# Altium schematic sheet MiniSystem&Ports.SchDoc: K60最小系统及接口
size A3; DrawnBy: 罗琪; Engineer: 罗琪; Revision: 4.0; SheetNumber: 1
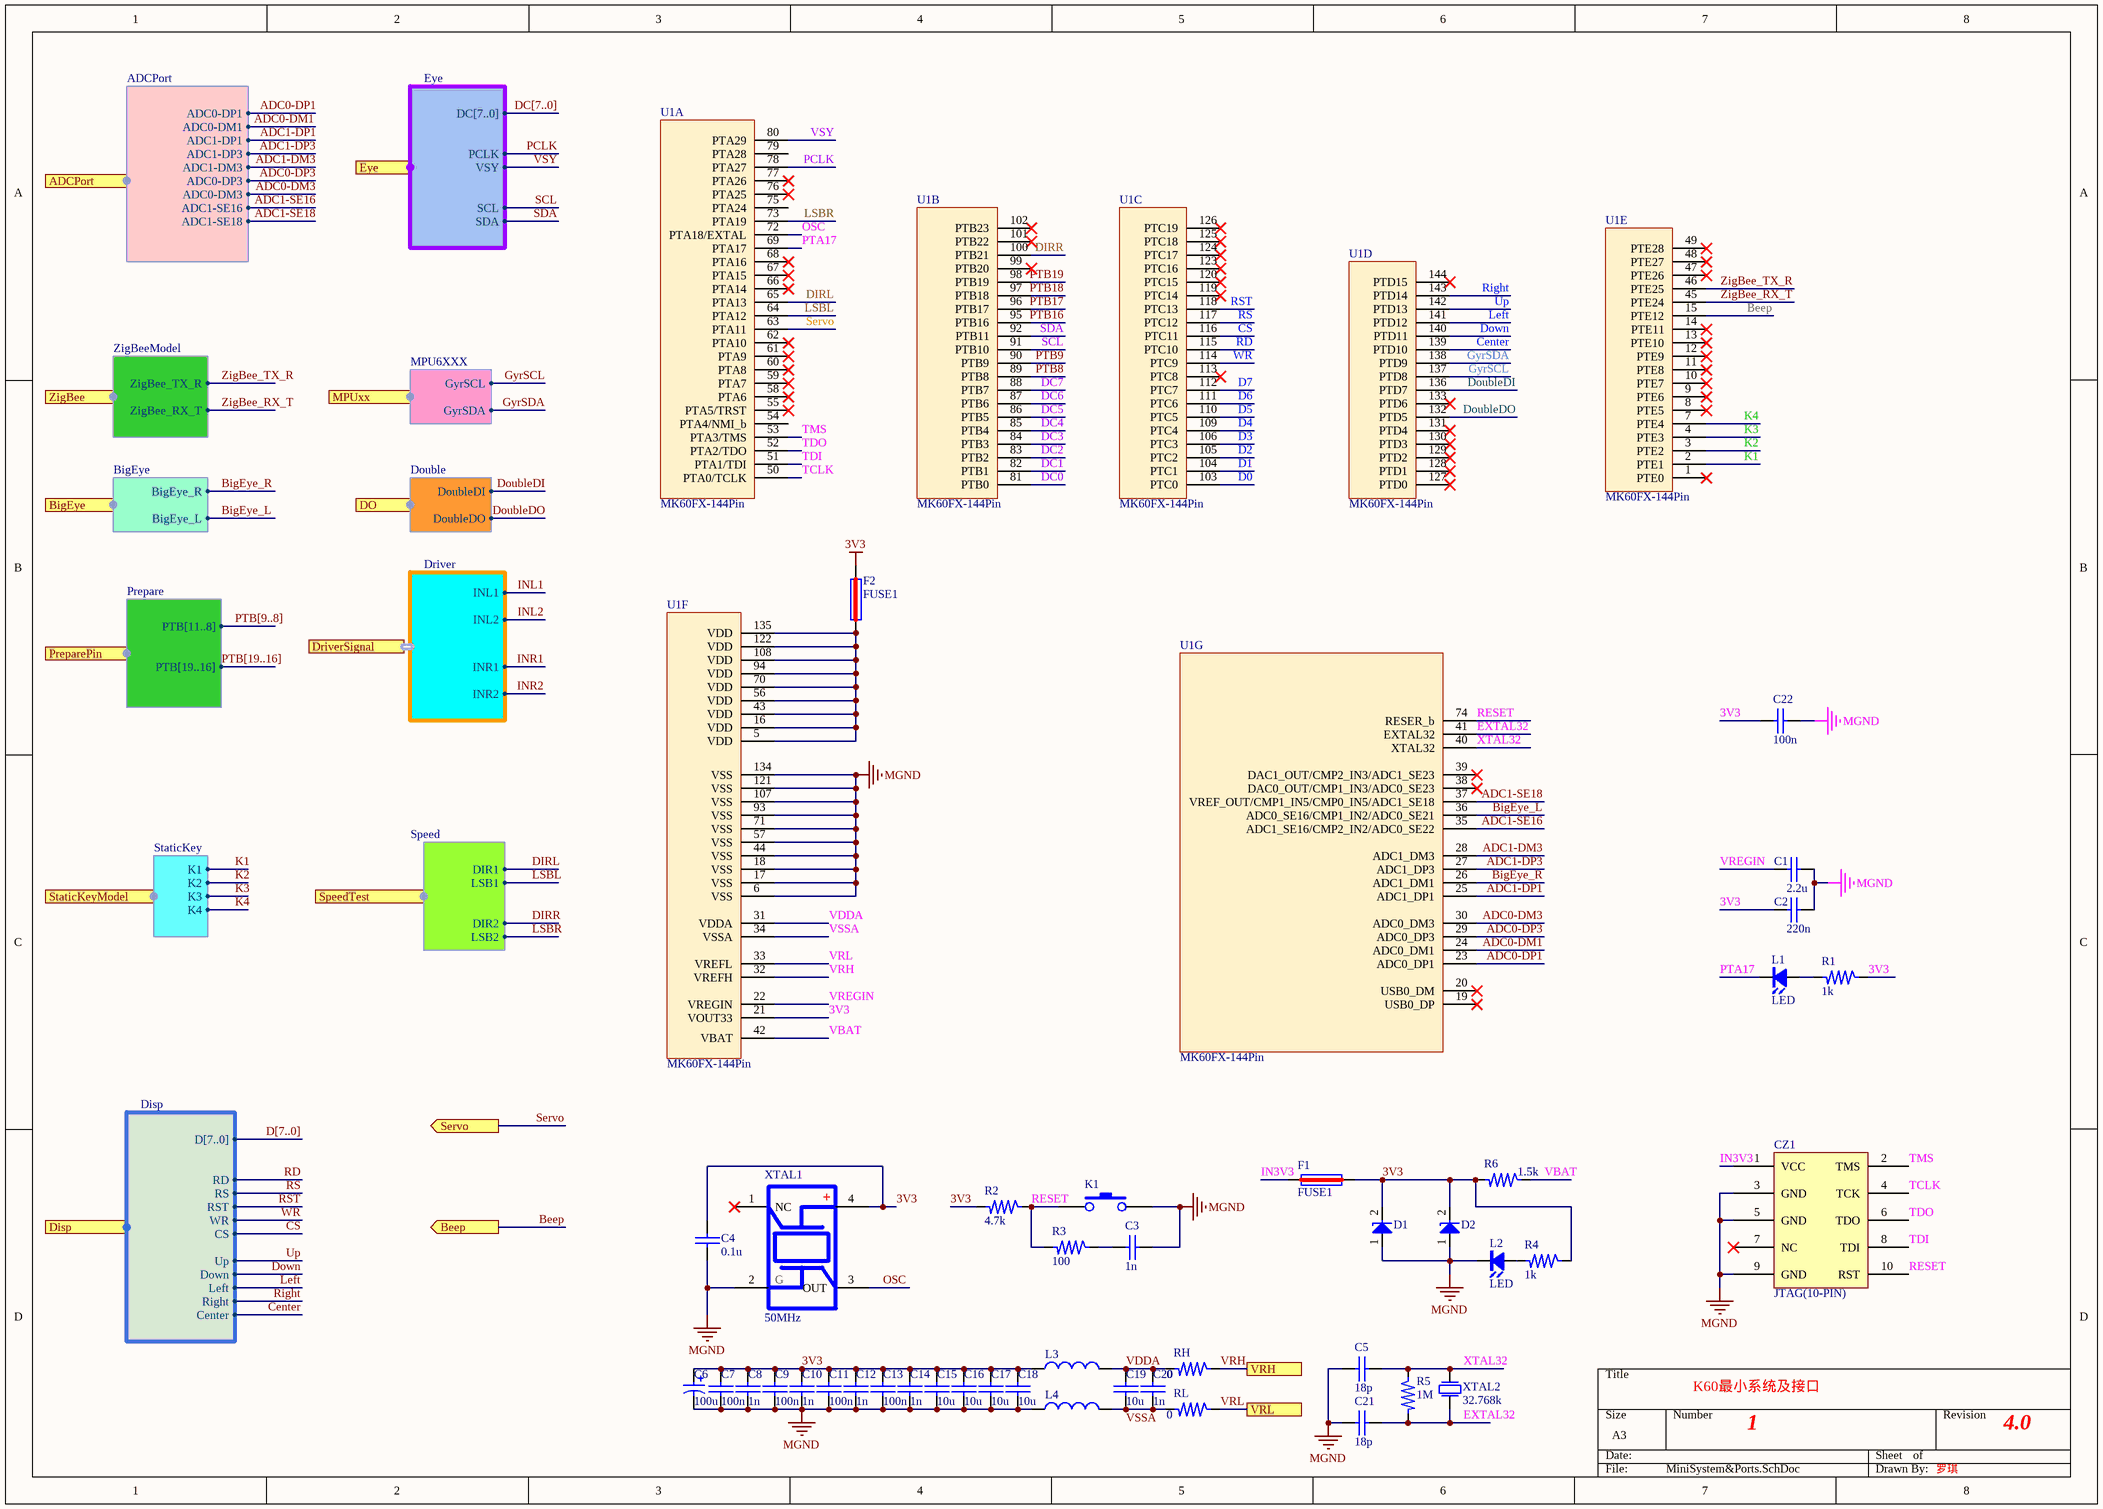
[diagram p0: MiniSystem&Ports.SchDoc]

## Parts
C1  2.2u  [C0603]
C2  220n  [C0603]
C3  1n  [C0603]
C4  0.1u  [C0603]
C5  18p  [C0603]
C6  100u  [CAP-E SMD-C]
C7  100n  [C0603]
C8  1n  [C0603]
C9  100n  [C0603]
C10  1n  [C0603]
C11  100n  [C0603]
C12  1n  [C0603]
C13  100n  [C0603]
C14  1n  [C0603]
C15  10u  [C0805]
C16  10u  [C0805]
C17  10u  [C0805]
C18  10u  [C0805]
C19  10u  [C0805]
C20  1n  [C0603]
C21  18p  [C0603]
C22  100n  [C0603]
CZ1  JTAG(10-PIN)  [JTAG 10-pin Header]
D1  EN5819  [D1206]  (value not drawn)
D2  EN5819  [D1206]  (value not drawn)
F1  FUSE1  [FUSE-F1210]
F2  FUSE1  [FUSE-F1210]
K1  SW  [KEY-K2]  (value not drawn)
L1  LED  [LED0805TB]
L2  LED  [LED0805TB]
L3  INDUCTOR  [L0805]  (value not drawn)
L4  INDUCTOR  [L0805]  (value not drawn)
R1  1k  [R0603]
R2  4.7k  [R0603]
R3  100  [R0603]
R4  1k  [R0603]
R5  1M  [R0603]
R6  1.5k  [R0603]
RH  0  [R0603]
RL  0  [R0603]
U1  MK60FX-144Pin  [LQFP144]  (parts A,B,C,D,E,F,G of 7)
XTAL1  50MHz  [XTAL-6035]
XTAL2  32.768k  [XTAL_32.768]

## Ports
ADCPort (harness ADCPort), Beep (out), BigEye (harness BigEye), Disp (harness Disp), DO (harness Double), DriverSignal (harness Driver), Eye (harness Eye), MPUxx (harness MPU6XXX), PreparePin (harness Prepare), Servo (out), SpeedTest (harness Speed), StaticKeyModel (harness StaticKey), VRH, VRL, ZigBee (harness ZigBeeModel)

## Harnesses
MPU6XXX: GyrSCL, GyrSDA
ZigBeeModel: ZigBee_TX_R, ZigBee_RX_T
BigEye: BigEye_R, BigEye_L
Double: DoubleDI, DoubleDO
ADCPort: ADC0-DP1, ADC0-DM1, ADC1-DP1, ADC1-DP3, ADC1-DM3, ADC0-DP3, ADC0-DM3, ADC1-SE16, ADC1-SE18
Prepare: PTB[11..8], PTB[19..16]
Driver: INL1, INL2, INR1, INR2
Disp: D[7..0], RD, RS, RST, WR, Up, Down, Left, Right, Center, CS
Eye: DC[7..0], PCLK, VSY, SCL, SDA
StaticKey: K1, K2, K3, K4
Speed: DIR1, LSB1, LSB2, DIR2

## Nets
3V3: C2.2 C4.1 C6.1 C7.2 C8.2 C9.2 C10.2 C11.2 C12.2 C13.2 C14.2 C15.2 C16.2 C17.2 C18.2 C22.1 D1.2 D2.2 F1.2 F2.2 L3.1 R1.2 R2.1 R4.2 R6.1 U1.21(VOUT33) XTAL1.4(VCC)
MGND: C1.1 C2.1 C3.2 C4.2 C5.1 C6.2 C7.1 C8.1 C9.1 C10.1 C11.1 C12.1 C13.1 C14.1 C15.1 C16.1 C17.1 C18.1 C21.1 C22.2 CZ1.3(GND) CZ1.5(GND) CZ1.9(GND) D1.1 D2.1 K1.2 L2.2(K) L4.1 U1.6(VSS) U1.17(VSS) U1.18(VSS) U1.44(VSS) U1.57(VSS) U1.71(VSS) U1.93(VSS) U1.107(VSS) U1.121(VSS) U1.134(VSS) XTAL1.2(GND)
ADC0-DM1: U1.24(ADC0_DM1) ; port ADCPort.ADC0-DM1
ADC0-DM3: U1.30(ADC0_DM3) ; port ADCPort.ADC0-DM3
ADC0-DP1: U1.23(ADC0_DP1) ; port ADCPort.ADC0-DP1
ADC0-DP3: U1.29(ADC0_DP3) ; port ADCPort.ADC0-DP3
ADC1-DM3: U1.28(ADC1_DM3) ; port ADCPort.ADC1-DM3
ADC1-DP1: U1.25(ADC1_DP1) ; port ADCPort.ADC1-DP1
ADC1-DP3: U1.27(ADC1_DP3) ; port ADCPort.ADC1-DP3
ADC1-SE16: U1.35(ADC1_SE16/CMP2_IN2/ADC0_SE22) ; port ADCPort.ADC1-SE16
ADC1-SE18: U1.37(VREF_OUT/CMP1_IN5/CMP0_IN5/ADC1_SE18) ; port ADCPort.ADC1-SE18
Beep: U1.15(PTE12) ; port Beep
BigEye_L: U1.36(ADC0_SE16/CMP1_IN2/ADC0_SE21) ; port BigEye.BigEye_L
BigEye_R: U1.26(ADC1_DM1) ; port BigEye.BigEye_R
Center: U1.139(PTD10) ; port Disp.Center
CS: U1.116(PTC11) ; port Disp.CS
D0: U1.103(PTC0)
D1: U1.104(PTC1)
D2: U1.105(PTC2)
D3: U1.106(PTC3)
D4: U1.109(PTC4)
D5: U1.110(PTC5)
D6: U1.111(PTC6)
D7: U1.112(PTC7)
DC0: U1.81(PTB0)
DC1: U1.82(PTB1)
DC2: U1.83(PTB2)
DC3: U1.84(PTB3)
DC4: U1.85(PTB4)
DC5: U1.86(PTB5)
DC6: U1.87(PTB6)
DC7: U1.88(PTB7)
DIRL: U1.65(PTA13) ; port SpeedTest.DIR1
DIRR: U1.100(PTB21) ; port SpeedTest.DIR2
DoubleDI: U1.136(PTD7) ; port DO.DoubleDI
DoubleDO: U1.132(PTD5) ; port DO.DoubleDO
Down: U1.140(PTD11) ; port Disp.Down
EXTAL32: C21.2 R5.1 U1.41(EXTAL32) XTAL2.2(P2)
GyrSCL: U1.137(PTD8) ; port MPUxx.GyrSCL
GyrSDA: U1.138(PTD9) ; port MPUxx.GyrSDA
IN3V3: CZ1.1(VCC) F1.1
INL1: port DriverSignal.INL1
INL2: port DriverSignal.INL2
INR1: port DriverSignal.INR1
INR2: port DriverSignal.INR2
K1: U1.2(PTE1) ; port StaticKeyModel.K1
K2: U1.3(PTE2) ; port StaticKeyModel.K2
K3: U1.4(PTE3) ; port StaticKeyModel.K3
K4: U1.7(PTE4) ; port StaticKeyModel.K4
Left: U1.141(PTD12) ; port Disp.Left
LSBL: U1.64(PTA12) ; port SpeedTest.LSB1
LSBR: U1.73(PTA19) ; port SpeedTest.LSB2
OSC: U1.72(PTA18/EXTAL) XTAL1.3(OUT)
PCLK: U1.78(PTA27) ; port Eye.PCLK
PTA17: L1.2(K) U1.69(PTA17)
PTB8: U1.89(PTB8)
PTB9: U1.90(PTB9)
PTB16: U1.95(PTB16)
PTB17: U1.96(PTB17)
PTB18: U1.97(PTB18)
PTB19: U1.98(PTB19)
RD: U1.115(PTC10) ; port Disp.RD
RESET: CZ1.10(RST) K1.1 R2.2 R3.1 U1.74(RESER_b)
Right: U1.143(PTD14) ; port Disp.Right
RS: U1.117(PTC12) ; port Disp.RS
RST: U1.118(PTC13) ; port Disp.RST
SCL: U1.91(PTB10) ; port Eye.SCL
SDA: U1.92(PTB11) ; port Eye.SDA
Servo: U1.63(PTA11) ; port Servo
TCLK: CZ1.4(TCK) U1.50(PTA0/TCLK)
TDI: CZ1.8(TDI) U1.51(PTA1/TDI)
TDO: CZ1.6(TDO) U1.52(PTA2/TDO)
TMS: CZ1.2(TMS) U1.53(PTA3/TMS)
Up: U1.142(PTD13) ; port Disp.Up
VBAT: R6.2 U1.42(VBAT)
VDDA: C19.2 C20.2 L3.2 RH.1 U1.31(VDDA)
VREGIN: C1.2 U1.22(VREGIN)
VRH: RH.2 U1.32(VREFH) ; port VRH
VRL: RL.2 U1.33(VREFL) ; port VRL
VSSA: C19.1 C20.1 L4.2 RL.1 U1.34(VSSA)
VSY: U1.80(PTA29) ; port Eye.VSY
WR: U1.114(PTC9) ; port Disp.WR
XTAL32: C5.2 R5.2 U1.40(XTAL32) XTAL2.1(P1)
ZigBee_RX_T: U1.45(PTE24) ; port ZigBee.ZigBee_RX_T
ZigBee_TX_R: U1.46(PTE25) ; port ZigBee.ZigBee_TX_R
NetC3_1: C3.1 R3.2
NetF2_1: F2.1 U1.5(VDD) U1.16(VDD) U1.43(VDD) U1.56(VDD) U1.70(VDD) U1.94(VDD) U1.108(VDD) U1.122(VDD) U1.135(VDD)
NetL1_1: L1.1(A) R1.1
NetL2_1: L2.1(A) R4.1

Not connected (* = marked no-connect by the designer): CZ1 7(NC)*; U1 1(PTE0)* 8(PTE5)* 9(PTE6)* 10(PTE7)* 11(PTE8)* 12(PTE9)* 13(PTE10)* 14(PTE11)* 19(USB0_DP)* 20(USB0_DM)* 38(DAC0_OUT/CMP1_IN3/ADC0_SE23)* 39(DAC1_OUT/CMP2_IN3/ADC1_SE23)* 47(PTE26)* 48(PTE27)* 49(PTE28)* 54(PTA4/NMI_b) 55(PTA5/TRST)* 58(PTA6)* 59(PTA7)* 60(PTA8)* 61(PTA9)* 62(PTA10)* 66(PTA14)* 67(PTA15)* 68(PTA16)* 75(PTA24) 76(PTA25)* 77(PTA26)* 79(PTA28) 99(PTB20)* 101(PTB22)* 102(PTB23)* 113(PTC8)* 119(PTC14)* 120(PTC15)* 123(PTC16)* 124(PTC17)* 125(PTC18)* 126(PTC19)* 127(PTD0)* 128(PTD1)* 129(PTD2)* 130(PTD3)* 131(PTD4)* 133(PTD6)* 144(PTD15)*; XTAL1 1(NC)*

## Buses and harness runs
bus D[7..0]
bus DC[7..0]
bus PTB[9..8]
bus PTB[19..16]

## Notes on the sheet
- (in symbol XTAL-Active) +; G

## Library data of the parts
C1-C5 C7-C22 = Capacitor: 电容
C6 = Capacitor-Polarity: 极性电容
D1 D2 = DIODE稳压
F1 F2 = FUSE1: FUSE
K1 = KEY: 按键
R1-R6 RH RL = Resistor: 电阻
U1 = MK60FX144
XTAL1 = XTAL-Active
XTAL2 = XTAL: CRYSTAL